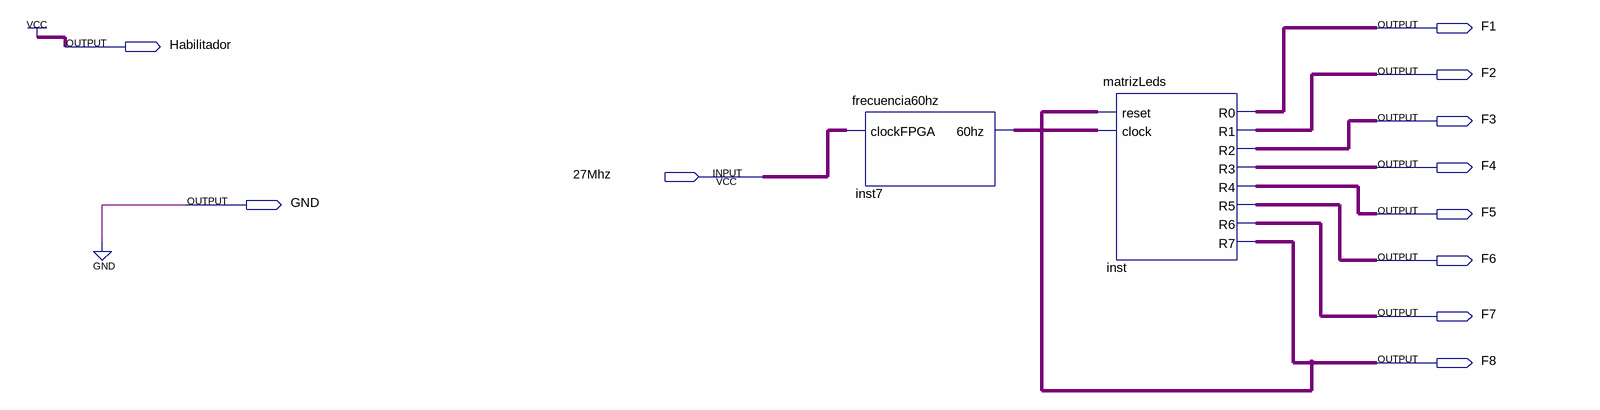
[diagram p0: schematic sheet]
// Quartus schematic Esquema.bdf as structural Verilog: 2 symbols, 11 pins
module Esquema (
  input  \27Mhz ,
  output F1,
  output Habilitador,
  output F2,
  output F3,
  output F4,
  output GND,
  output F5,
  output F6,
  output F7,
  output F8
);

  wire inst7_60hz;

  frecuencia60hz inst7 (.clockFPGA(\27Mhz ), .\60hz (inst7_60hz));
  matrizLeds inst (
    .reset(F8), .clock(inst7_60hz), .R0(F1), .R1(F2), .R2(F3), .R3(F4), .R4(F5), .R5(F6), .R6(F7), .R7(F8));

  assign GND = 1'b0;
  assign Habilitador = 1'b1;
endmodule
